# Altium schematic sheet SoC_PS_500_501_502_MIO.SchDoc: RFSoC AMC
size 420 x 297 mm; CompanyName: WUT; DrawnBy: T. Przywozki; Organization: WUT ISE; Address1: Warsaw University of Technology; Address2: Nowowiejska 15/19 00-665 Warsaw; Address3: Tomasz.Przywozki@pw.edu.pl; DocumentNumber: 8; Revision: 1; SheetNumber: 8; SheetTotal: 45; Project: RFSoC AMC; ModifiedBy: T. Przywozki; CreateDate: -; CheckedDate: -; DivGrp: ISE; Designer: T. Przywozki; ModifiedDate: -; ProjectName: ADC/DAC MEZZANINE
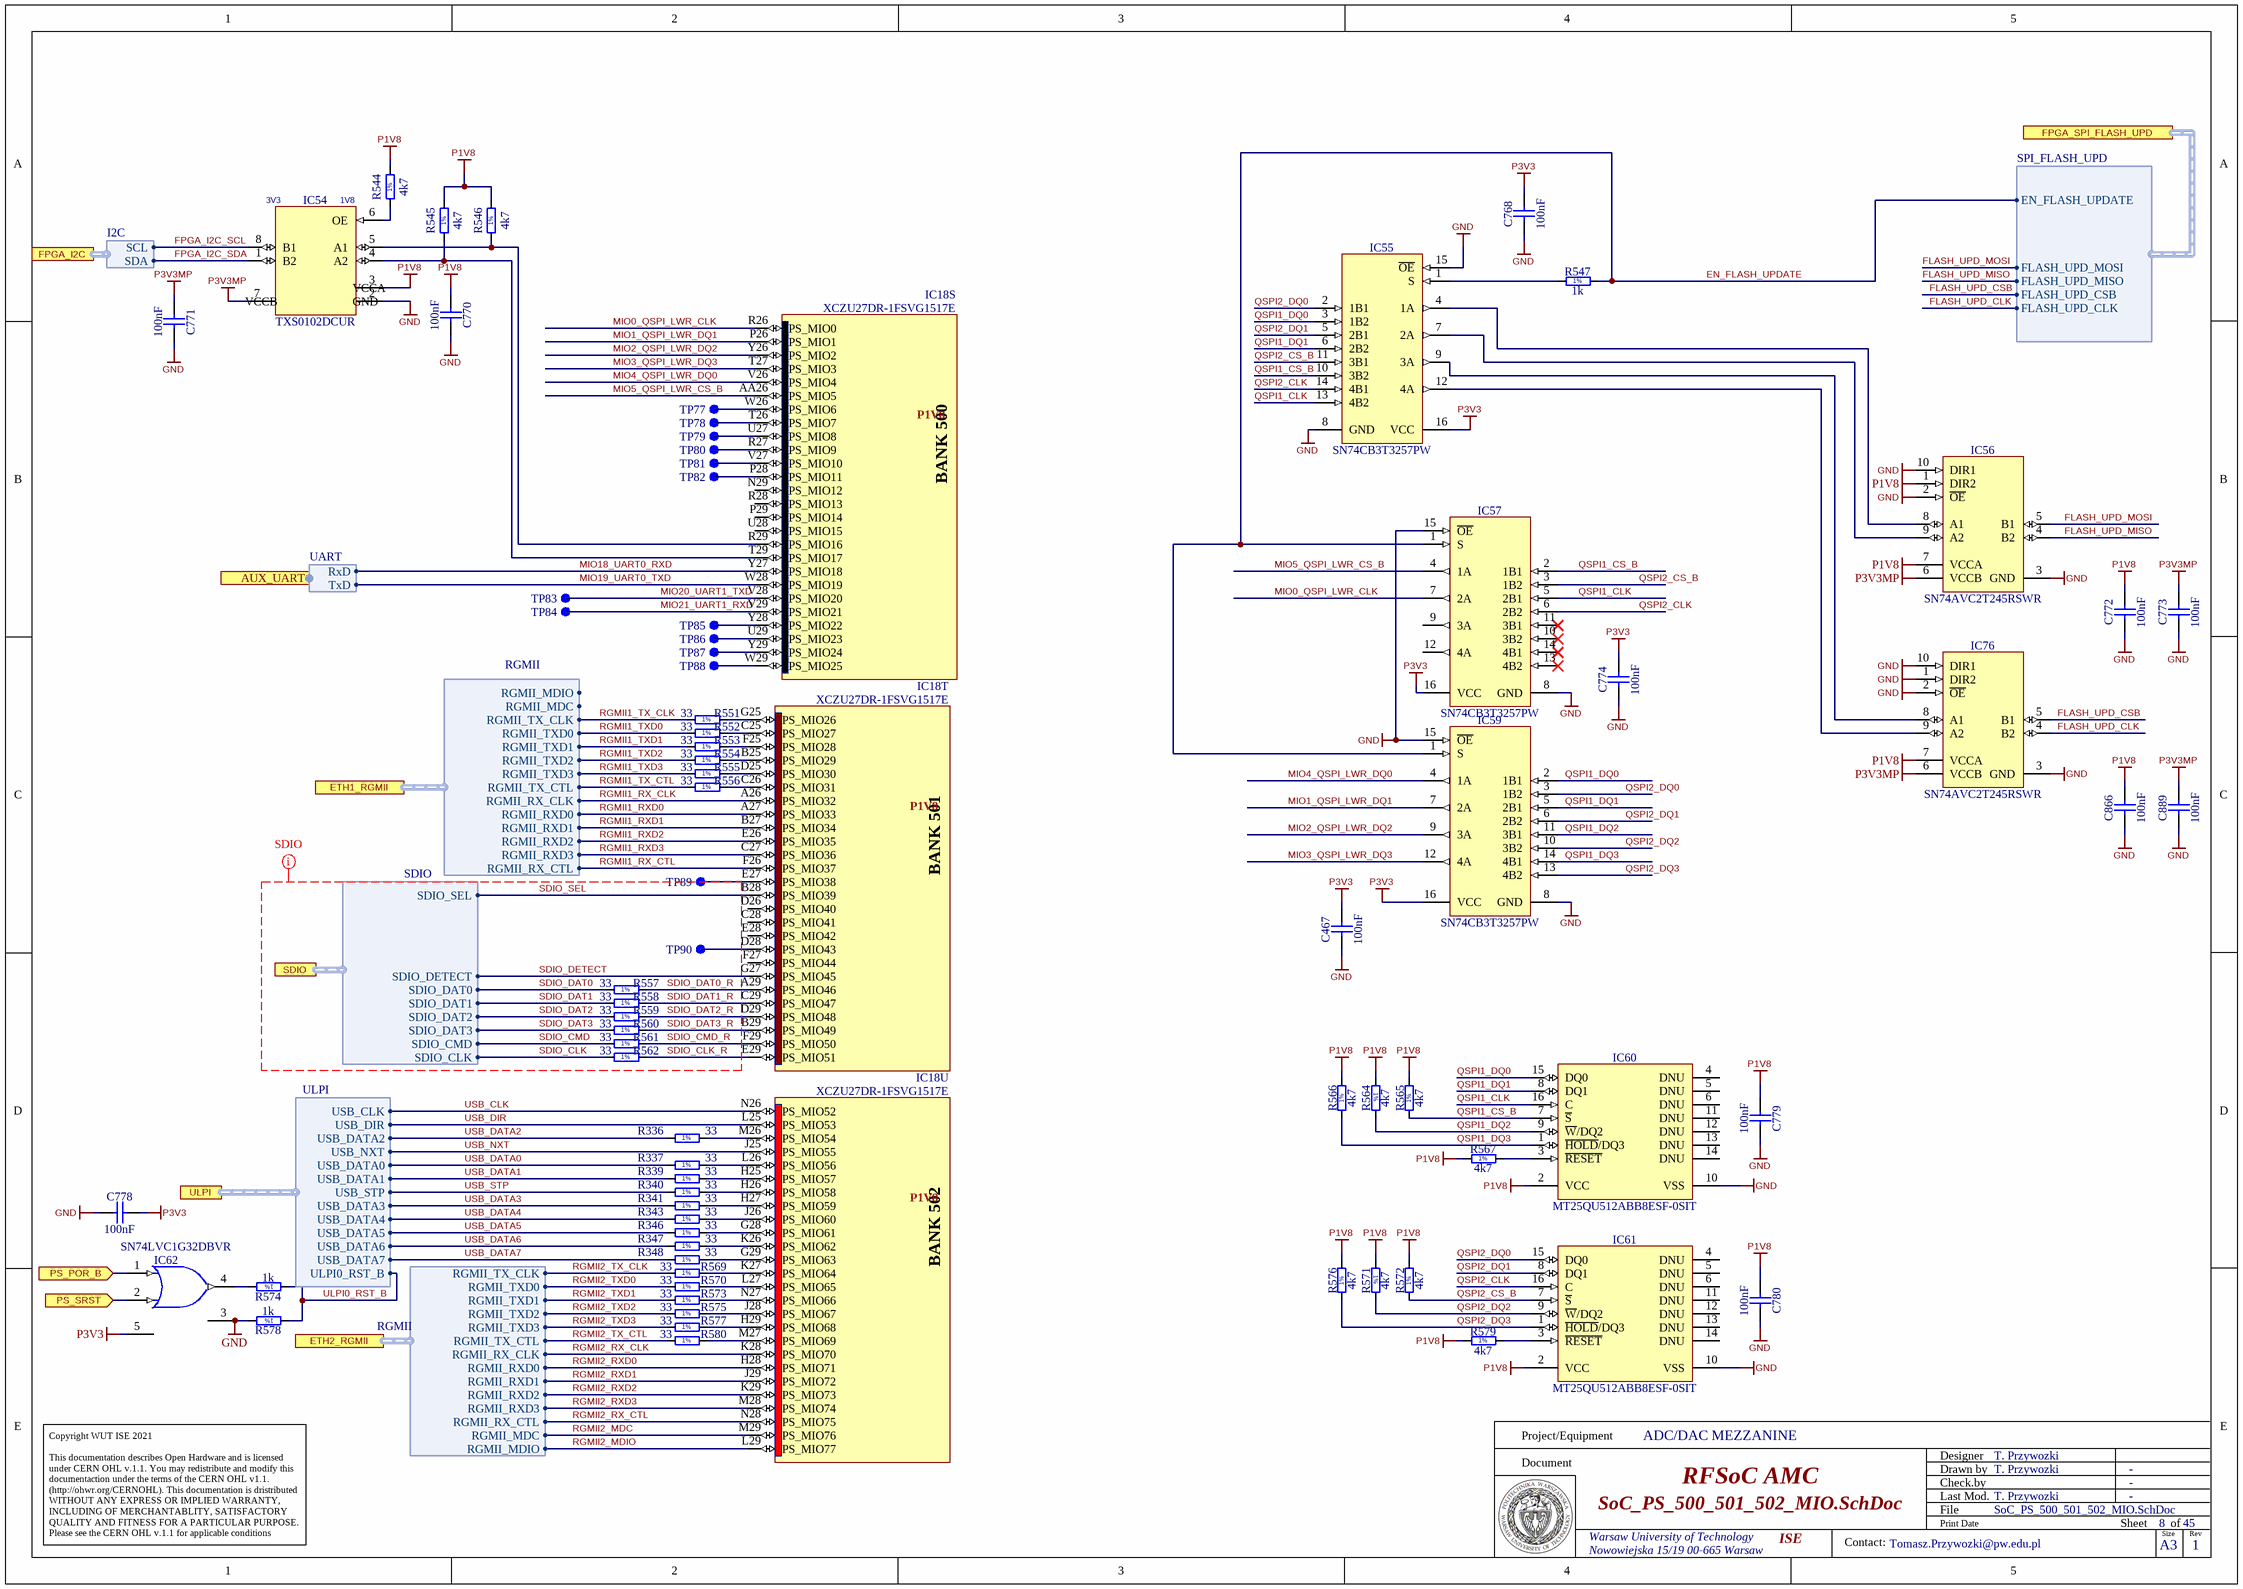
[diagram p0: SoC_PS_500_501_502_MIO.SchDoc]

## Parts
C467  100nF  [CAPC0603X33N]
C768  100nF  [CAPC0603X33N]
C770  100nF  [CAPC0603X33N]
C771  100nF  [CAPC0603X33N]
C772  100nF  [CAPC0603X33N]
C773  100nF  [CAPC0603X33N]
C774  100nF  [CAPC0603X33N]
C778  100nF  [CAPC0603X33N]
C779  100nF  [CAPC0603X33N]
C780  100nF  [CAPC0603X33N]
C866  100nF  [CAPC0603X33N]
C889  100nF  [CAPC0603X33N]
IC18  XCZU27DR-1FSVG1517E  [XILINX_FSVG1517 (XCZU27DR)]  (parts S,T,U of 31)
IC54  TXS0102DCUR  [SOP50P310X90-8N]
IC55  SN74CB3T3257PW  [SOP65P640X120-16N]
IC56  SN74AVC2T245RSWR  [QFN40P140X180X55-10N]
IC57  SN74CB3T3257PW  [SOP65P640X120-16N]
IC59  SN74CB3T3257PW  [SOP65P640X120-16N]
IC60  MT25QU512ABB8ESF-0SIT  [SOIC127P1030X265-16N]
IC61  MT25QU512ABB8ESF-0SIT  [SOIC127P1030X265-16N]
IC62  SN74LVC1G32DBVR  [SOT95P280X145-5N]
IC76  SN74AVC2T245RSWR  [QFN40P140X180X55-10N]
R336  33  [RESC1005X40N]
R337  33  [RESC1005X40N]
R339  33  [RESC1005X40N]
R340  33  [RESC1005X40N]
R341  33  [RESC1005X40N]
R343  33  [RESC1005X40N]
R346  33  [RESC1005X40N]
R347  33  [RESC1005X40N]
R348  33  [RESC1005X40N]
R544  4k7  [RESC1005X40N]
R545  4k7  [RESC1005X40N]
R546  4k7  [RESC1005X40N]
R547  1k  [RESC1005X40N]
R551  33  [RESC1005X40N]
R552  33  [RESC1005X40N]
R553  33  [RESC1005X40N]
R554  33  [RESC1005X40N]
R555  33  [RESC1005X40N]
R556  33  [RESC1005X40N]
R557  33  [RESC1005X40N]
R558  33  [RESC1005X40N]
R559  33  [RESC1005X40N]
R560  33  [RESC1005X40N]
R561  33  [RESC1005X40N]
R562  33  [RESC1005X40N]
R564  4k7  [RESC1005X40N]
R565  4k7  [RESC1005X40N]
R566  4k7  [RESC1005X40N]
R567  4k7  [RESC1005X40N]
R569  33  [RESC1005X40N]
R570  33  [RESC1005X40N]
R571  4k7  [RESC1005X40N]
R572  4k7  [RESC1005X40N]
R573  33  [RESC1005X40N]
R574  1k  [RESC1005X40N]
R575  33  [RESC1005X40N]
R576  4k7  [RESC1005X40N]
R577  33  [RESC1005X40N]
R578  1k  [RESC1005X40N]
R579  4k7  [RESC1005X40N]
R580  33  [RESC1005X40N]
TP77  SMD Pad  [C100]  (value not drawn)
TP78  SMD Pad  [C100]  (value not drawn)
TP79  SMD Pad  [C100]  (value not drawn)
TP80  SMD Pad  [C100]  (value not drawn)
TP81  SMD Pad  [C100]  (value not drawn)
TP82  SMD Pad  [C100]  (value not drawn)
TP83  SMD Pad  [C100]  (value not drawn)
TP84  SMD Pad  [C100]  (value not drawn)
TP85  SMD Pad  [C100]  (value not drawn)
TP86  SMD Pad  [C100]  (value not drawn)
TP87  SMD Pad  [C100]  (value not drawn)
TP88  SMD Pad  [C100]  (value not drawn)
TP89  SMD Pad  [C100]  (value not drawn)
TP90  SMD Pad  [C100]  (value not drawn)

## Ports
AUX_UART (harness UART), ETH1_RGMII (harness RGMII), ETH2_RGMII (harness RGMII), FPGA_I2C (harness I2C), FPGA_SPI_FLASH_UPD (harness SPI_FLASH_UPD), PS_POR_B (in), PS_SRST (in), SDIO (harness SDIO), ULPI (harness ULPI)

## Harnesses
SDIO: SDIO_SEL, SDIO_DETECT, SDIO_DAT0, SDIO_DAT1, SDIO_DAT2, SDIO_DAT3, SDIO_CMD, SDIO_CLK
SPI_FLASH_UPD: EN_FLASH_UPDATE, FLASH_UPD_MOSI, FLASH_UPD_MISO, FLASH_UPD_CSB, FLASH_UPD_CLK
I2C: SCL, SDA
ULPI: USB_CLK, USB_DIR, USB_DATA2, USB_NXT, USB_DATA0, USB_DATA1, USB_STP, USB_DATA3, USB_DATA4, USB_DATA5, USB_DATA6, USB_DATA7, ULPI0_RST_B
RGMII: RGMII_TX_CLK, RGMII_TXD0, RGMII_TXD1, RGMII_TXD2, RGMII_TXD3, RGMII_TX_CTL, RGMII_RX_CLK, RGMII_RXD0, RGMII_RXD1, RGMII_RXD2, RGMII_RXD3, RGMII_RX_CTL, RGMII_MDC, RGMII_MDIO
UART: RxD, TxD

## Nets
GND: C467.1 C768.1 C770.1 C771.1 C772.1 C773.1 C774.1 C778.1 C779.1 C780.1 C866.1 C889.1 IC54.2(GND) IC55.8(GND) IC55.15(~{OE}) IC56.2(~{OE}) IC56.3(GND) IC56.10(DIR1) IC57.8(GND) IC57.15(~{OE}) IC59.8(GND) IC59.15(~{OE}) IC60.10(VSS) IC61.10(VSS) IC62.3(GND) IC76.1(DIR2) IC76.2(~{OE}) IC76.3(GND) IC76.10(DIR1) R578.2
P1V8: C770.2 C772.2 C779.2 C780.2 C866.2 IC54.3(Vcca) IC56.1(DIR2) IC56.7(VCCA) IC60.2(VCC) IC61.2(VCC) IC76.7(VCCA) R544.2 R545.2 R546.2 R564.1 R565.2 R566.2 R567.1 R571.1 R572.2 R576.2 R579.1
P3V3: C467.2 C768.2 C774.2 C778.2 IC55.16(VCC) IC57.16(VCC) IC59.16(VCC) IC62.5(VCC)
P3V3MP: C771.2 C773.2 C889.2 IC54.7(Vccb) IC56.6(VCCB) IC76.6(VCCB)
EN_FLASH_UPDATE: IC57.1(S) IC59.1(S) R547.2 ; port FPGA_SPI_FLASH_UPD.EN_FLASH_UPDATE
FLASH_UPD_CLK: IC76.4(B2) ; port FPGA_SPI_FLASH_UPD.FLASH_UPD_CLK
FLASH_UPD_CSB: IC76.5(B1) ; port FPGA_SPI_FLASH_UPD.FLASH_UPD_CSB
FLASH_UPD_MISO: IC56.4(B2) ; port FPGA_SPI_FLASH_UPD.FLASH_UPD_MISO
FLASH_UPD_MOSI: IC56.5(B1) ; port FPGA_SPI_FLASH_UPD.FLASH_UPD_MOSI
FPGA_I2C_SCL: IC54.8(B1) ; port FPGA_I2C.SCL
FPGA_I2C_SDA: IC54.1(B2) ; port FPGA_I2C.SDA
MIO0_QSPI_LWR_CLK: IC18.R26(PS_MIO0) IC57.7(2A)
MIO1_QSPI_LWR_DQ1: IC18.P26(PS_MIO1) IC59.7(2A)
MIO2_QSPI_LWR_DQ2: IC18.Y26(PS_MIO2) IC59.9(3A)
MIO3_QSPI_LWR_DQ3: IC18.T27(PS_MIO3) IC59.12(4A)
MIO4_QSPI_LWR_DQ0: IC18.V26(PS_MIO4) IC59.4(1A)
MIO5_QSPI_LWR_CS_B: IC18.AA26(PS_MIO5) IC57.4(1A)
MIO18_UART0_RXD: IC18.Y27(PS_MIO18) ; port AUX_UART.RxD
MIO19_UART0_TXD: IC18.W28(PS_MIO19) ; port AUX_UART.TxD
MIO20_UART1_TXD: IC18.V28(PS_MIO20) TP83.1
MIO21_UART1_RXD: IC18.V29(PS_MIO21) TP84.1
PS_POR_B: IC62.1(A) ; port PS_POR_B
PS_SRST: IC62.2(B) ; port PS_SRST
QSPI1_CLK: IC55.13(4B2) IC57.5(2B1) IC60.16(C)
QSPI1_CS_B: IC55.10(3B2) IC57.2(1B1) IC60.7(~{S}) R565.1
QSPI1_DQ0: IC55.3(1B2) IC59.2(1B1) IC60.15(DQ0)
QSPI1_DQ1: IC55.6(2B2) IC59.5(2B1) IC60.8(DQ1)
QSPI1_DQ2: IC59.11(3B1) IC60.9(~{W}/DQ2) R564.2
QSPI1_DQ3: IC59.14(4B1) IC60.1(~{HOLD}/DQ3) R566.1
QSPI2_CLK: IC55.14(4B1) IC57.6(2B2) IC61.16(C)
QSPI2_CS_B: IC55.11(3B1) IC57.3(1B2) IC61.7(~{S}) R572.1
QSPI2_DQ0: IC55.2(1B1) IC59.3(1B2) IC61.15(DQ0)
QSPI2_DQ1: IC55.5(2B1) IC59.6(2B2) IC61.8(DQ1)
QSPI2_DQ2: IC59.10(3B2) IC61.9(~{W}/DQ2) R571.2
QSPI2_DQ3: IC59.13(4B2) IC61.1(~{HOLD}/DQ3) R576.1
RGMII1_RX_CLK: IC18.A26(PS_MIO32) ; port ETH1_RGMII.RGMII_RX_CLK
RGMII1_RX_CTL: IC18.F26(PS_MIO37) ; port ETH1_RGMII.RGMII_RX_CTL
RGMII1_RXD0: IC18.A27(PS_MIO33) ; port ETH1_RGMII.RGMII_RXD0
RGMII1_RXD1: IC18.B27(PS_MIO34) ; port ETH1_RGMII.RGMII_RXD1
RGMII1_RXD2: IC18.E26(PS_MIO35) ; port ETH1_RGMII.RGMII_RXD2
RGMII1_RXD3: IC18.C27(PS_MIO36) ; port ETH1_RGMII.RGMII_RXD3
RGMII1_TX_CLK: R551.1 ; port ETH1_RGMII.RGMII_TX_CLK
RGMII1_TX_CTL: R556.1 ; port ETH1_RGMII.RGMII_TX_CTL
RGMII1_TXD0: R552.1 ; port ETH1_RGMII.RGMII_TXD0
RGMII1_TXD1: R553.1 ; port ETH1_RGMII.RGMII_TXD1
RGMII1_TXD2: R554.1 ; port ETH1_RGMII.RGMII_TXD2
RGMII1_TXD3: R555.1 ; port ETH1_RGMII.RGMII_TXD3
RGMII2_MDC: IC18.M29(PS_MIO76) ; port ETH2_RGMII.RGMII_MDC
RGMII2_MDIO: IC18.L29(PS_MIO77) ; port ETH2_RGMII.RGMII_MDIO
RGMII2_RX_CLK: IC18.K28(PS_MIO70) ; port ETH2_RGMII.RGMII_RX_CLK
RGMII2_RX_CTL: IC18.N28(PS_MIO75) ; port ETH2_RGMII.RGMII_RX_CTL
RGMII2_RXD0: IC18.H28(PS_MIO71) ; port ETH2_RGMII.RGMII_RXD0
RGMII2_RXD1: IC18.J29(PS_MIO72) ; port ETH2_RGMII.RGMII_RXD1
RGMII2_RXD2: IC18.K29(PS_MIO73) ; port ETH2_RGMII.RGMII_RXD2
RGMII2_RXD3: IC18.M28(PS_MIO74) ; port ETH2_RGMII.RGMII_RXD3
RGMII2_TX_CLK: R569.1 ; port ETH2_RGMII.RGMII_TX_CLK
RGMII2_TX_CTL: R580.1 ; port ETH2_RGMII.RGMII_TX_CTL
RGMII2_TXD0: R570.1 ; port ETH2_RGMII.RGMII_TXD0
RGMII2_TXD1: R573.1 ; port ETH2_RGMII.RGMII_TXD1
RGMII2_TXD2: R575.1 ; port ETH2_RGMII.RGMII_TXD2
RGMII2_TXD3: R577.1 ; port ETH2_RGMII.RGMII_TXD3
SDIO_CLK: R562.1 ; port SDIO.SDIO_CLK
SDIO_CLK_R: IC18.E29(PS_MIO51) R562.2
SDIO_CMD: R561.1 ; port SDIO.SDIO_CMD
SDIO_CMD_R: IC18.F29(PS_MIO50) R561.2
SDIO_DAT0: R557.1 ; port SDIO.SDIO_DAT0
SDIO_DAT0_R: IC18.A29(PS_MIO46) R557.2
SDIO_DAT1: R558.1 ; port SDIO.SDIO_DAT1
SDIO_DAT1_R: IC18.C29(PS_MIO47) R558.2
SDIO_DAT2: R559.1 ; port SDIO.SDIO_DAT2
SDIO_DAT2_R: IC18.D29(PS_MIO48) R559.2
SDIO_DAT3: R560.1 ; port SDIO.SDIO_DAT3
SDIO_DAT3_R: IC18.B29(PS_MIO49) R560.2
SDIO_DETECT: IC18.G27(PS_MIO45) ; port SDIO.SDIO_DETECT
SDIO_SEL: IC18.B28(PS_MIO39) ; port SDIO.SDIO_SEL
ULPI0_RST_B: R574.1 R578.1 ; port ULPI.ULPI0_RST_B
USB_CLK: IC18.N26(PS_MIO52) ; port ULPI.USB_CLK
USB_DATA0: R337.1 ; port ULPI.USB_DATA0
USB_DATA1: R339.1 ; port ULPI.USB_DATA1
USB_DATA2: R336.1 ; port ULPI.USB_DATA2
USB_DATA3: R341.1 ; port ULPI.USB_DATA3
USB_DATA4: R343.1 ; port ULPI.USB_DATA4
USB_DATA5: R346.1 ; port ULPI.USB_DATA5
USB_DATA6: R347.1 ; port ULPI.USB_DATA6
USB_DATA7: R348.1 ; port ULPI.USB_DATA7
USB_DIR: IC18.L25(PS_MIO53) ; port ULPI.USB_DIR
USB_NXT: IC18.J25(PS_MIO55) ; port ULPI.USB_NXT
USB_STP: R340.1 ; port ULPI.USB_STP
NetIC18_B25: IC18.B25(PS_MIO29) R554.2
NetIC18_C25: IC18.C25(PS_MIO27) R552.2
NetIC18_C26: IC18.C26(PS_MIO31) R556.2
NetIC18_D25: IC18.D25(PS_MIO30) R555.2
NetIC18_D28: IC18.D28(PS_MIO43) TP90.1
NetIC18_E27: IC18.E27(PS_MIO38) TP89.1
NetIC18_F25: IC18.F25(PS_MIO28) R553.2
NetIC18_G25: IC18.G25(PS_MIO26) R551.2
NetIC18_G28: IC18.G28(PS_MIO61) R346.2
NetIC18_G29: IC18.G29(PS_MIO63) R348.2
NetIC18_H25: IC18.H25(PS_MIO57) R339.2
NetIC18_H26: IC18.H26(PS_MIO58) R340.2
NetIC18_H27: IC18.H27(PS_MIO59) R341.2
NetIC18_H29: IC18.H29(PS_MIO68) R577.2
NetIC18_J26: IC18.J26(PS_MIO60) R343.2
NetIC18_J28: IC18.J28(PS_MIO67) R575.2
NetIC18_K26: IC18.K26(PS_MIO62) R347.2
NetIC18_K27: IC18.K27(PS_MIO64) R569.2
NetIC18_L26: IC18.L26(PS_MIO56) R337.2
NetIC18_L27: IC18.L27(PS_MIO65) R570.2
NetIC18_M26: IC18.M26(PS_MIO54) R336.2
NetIC18_M27: IC18.M27(PS_MIO69) R580.2
NetIC18_N27: IC18.N27(PS_MIO66) R573.2
NetIC18_P28: IC18.P28(PS_MIO11) TP82.1
NetIC18_R27: IC18.R27(PS_MIO9) TP80.1
NetIC18_R29: IC18.R29(PS_MIO16) IC54.5(A1) R546.1
NetIC18_T26: IC18.T26(PS_MIO7) TP78.1
NetIC18_T29: IC18.T29(PS_MIO17) IC54.4(A2) R545.1
NetIC18_U27: IC18.U27(PS_MIO8) TP79.1
NetIC18_U29: IC18.U29(PS_MIO23) TP86.1
NetIC18_V27: IC18.V27(PS_MIO10) TP81.1
NetIC18_W26: IC18.W26(PS_MIO6) TP77.1
NetIC18_W29: IC18.W29(PS_MIO25) TP88.1
NetIC18_Y28: IC18.Y28(PS_MIO22) TP85.1
NetIC18_Y29: IC18.Y29(PS_MIO24) TP87.1
NetIC54_6: IC54.6(OE) R544.1
NetIC55_1: IC55.1(S) R547.1
NetIC55_4: IC55.4(1A) IC56.8(A1)
NetIC55_7: IC55.7(2A) IC56.9(A2)
NetIC55_9: IC55.9(3A) IC76.8(A1)
NetIC55_12: IC55.12(4A) IC76.9(A2)
NetIC60_3: IC60.3(~{RESET}) R567.2
NetIC61_3: IC61.3(~{RESET}) R579.2
NetIC62_4: IC62.4(Y) R574.2

Not connected (* = marked no-connect by the designer): IC18 C28(PS_MIO41) D26(PS_MIO40) E28(PS_MIO42) F27(PS_MIO44) N29(PS_MIO12) P29(PS_MIO14) R28(PS_MIO13) U28(PS_MIO15); IC57 9(3A) 10(3B2)* 11(3B1)* 12(4A) 13(4B2)* 14(4B1)*; IC60 4(DNU) 5(DNU) 6(DNU) 11(DNU) 12(DNU) 13(DNU) 14(DNU); IC61 4(DNU) 5(DNU) 6(DNU) 11(DNU) 12(DNU) 13(DNU) 14(DNU)

## Layout directives
net class SDIO: SDIO_CLK, SDIO_CLK_R, SDIO_CMD, SDIO_CMD_R, SDIO_DAT0, SDIO_DAT0_R, SDIO_DAT1, SDIO_DAT1_R, SDIO_DAT2, SDIO_DAT2_R, SDIO_DAT3, SDIO_DAT3_R, SDIO_DETECT, SDIO_SEL

## Notes on the sheet
- (near IC54) 3V3
- (near IC54) 1V8
- P1V8
- Project/Equipment
- Document
- Designer
- Drawn by
- Check.by
- Copyright WUT ISE 2021
  This documentation describes Open Hardware and is licensed under CERN OHL v.1.1. You may redistribute and modify this documentaction under the terms of the CERN OHL v1.1.
  (http://ohwr.org/CERNOHL). This documentation is dristributed WITHOUT ANY EXPRESS OR IMPLIED WARRANTY, INCLUDING OF MERCHANTABLITY, SATISFACTORY QUALITY AND FITNESS FOR A PARTICULAR PURPOSE. Please see the CERN OHL v.1.1 for applicable conditions
- File
- Last Mod.
- Print Date
- Sheet
- Size
- A3
- of
- Rev
- Contact:
- (in symbol R0402_1K_1%_0.0625W_100PPM) 1%
- (in symbol R0402_4K7_1%_0.0625W_100PPM) 1%
- (in symbol R0402_33R_1%_0.0625W_100PPM) 1%
- (in symbol TXS0102DCUR) VCCA; VCCB
- (in symbol XCZU27DR-1FSVG1517E, part S) BANK 500
- (in symbol XCZU27DR-1FSVG1517E, part T) BANK 501
- (in symbol XCZU27DR-1FSVG1517E, part U) BANK 502

## Library data of the parts
C467 C768 C770-C774 C778-C780 C866 C889 = CC0201_100NF_6.3V_10%_X5R: Non-polarised capacitor; Manufacturer: GENERIC; Part Description: SMD Multilayer Chip Ceramic Capacitor; Manufacturer1 Part Number: 02016D104KAT2A; Tolerance: ±10%; Voltage: 6.3V; TC: X5R; Manufacturer Part Number: CC0201_100NF_6.3V_10%_X5R; Part Number: CC0201_100NF_6.3V_10%_X5R; Value: 100nF; Component Kind: Standard; Component Type: Standard; Pin Count: 2; Status: Not Recommended; Case: 0201; Mounted: Yes; Socket: No; SMD: Yes; Sense: No; Manufacturer1 Example: AVX; Manufacturer1 ComponentHeight: 0.33mm; HelpURL: \\cern.ch\dfs\Applications\Altium\Datasheets\CC0201_X5R_AVX.pdf; Author: CERN DEM JLC; CreateDate: 03/12/2007; LatestRevisionDate: 03/12/2007
IC18 = XCZU27DR-1FSVG1517E: Zynq UltraScale+ RFSoC, Quad-Core ARM® Cortex™-A53 MPCore™ up to 1.5GHz, 214 PS I/O, 299 HP I/O, 48 HD I/O, 1517-Pin BGA; Manufacturer: XILINX; PressFit: No; Bonding: No; Part Number: XCZU27DR-1FSVG1517E; Component Kind: Standard; Component Type: Standard; Device: XCZU27DR-1FSVG1517E; PackageDescription: BGA, 1.00mm Pitch, Square; 1517 Pin, 39 Columns X 39 Rows, 40.00mm X 40.00mm X 4.01mm H; Part Description: Zynq UltraScale+ RFSoC, Quad-Core ARM® Cortex™-A53 MPCore™ up to 1.5GHz, 214 PS I/O, 299 HP I/O, 48 HD I/O, 1517-Pin BGA; Manufacturer Part Number: XCZU27DR-1FSVG1517E; Pin Count: 1517; Case: BGA1517; Mounted: Yes; Socket: No; SMD: Yes; Sense: No; ComponentHeight: 4.01mm; HelpURL: \\cern.ch\dfs\Applications\Altium\Datasheets\XCZU27DR-1FSVG1517E.pdf; ComponentLink1URL: \\cern.ch\dfs\Applications\Altium\Datasheets\XCZU27DR-1FSVG1517E_Package-Pinout.pdf; ComponentLink1Description: Package/Pinout; ComponentLink2URL: \\cern.ch\dfs\Applications\Altium\Datasheets\XCZU27DR-1FSVG1517E_Pinout.pdf; ComponentLink2Description: Pinout; Author: CERN DEM MR; CreateDate: 02/05/2018; LatestRevisionDate: 02/05/2018
IC54 = TXS0102DCUR: 2-Bit Bidirectionnal Voltage-Level Translator for Open-Drain And Push-Pull Applications; Manufacturer: TEXAS INSTRUMENTS; PressFit: No; Bonding: No; Manufacturer Part Number: TXS0102DCUR; PackageDescription: SOP, 0.50mm Pitch; 8 pin, 2.30mm W X 2.00mm L X 0.90mm H body, PC Medium Density; Part Description: 2-Bit Bidirectionnal Voltage-Level Translator for Open-Drain And Push-Pull Applications; Part Number: TXS0102DCUR; Component Kind: Standard; Component Type: Standard; Device: TXS0102DCUR; Pin Count: 8; Case: TSSOP8; Mounted: Yes; Socket: No; SMD: Yes; Sense: No; ComponentHeight: 0.9mm; Author: CERN DEM JLC; HelpURL: \\cern.ch\dfs\Applications\Altium\Datasheets\TXS0102DCUR.pdf; CreateDate: 08/07/2014; LatestRevisionDate: 08/07/2014
IC55 IC57 IC59 = SN74CB3T3257PW: 4-BIT 1-OF-2 FET Multiplexer/Demultiplexer 2.5V/3.3V Low-Voltage Bus Switch 5V Tolerant Shifter; Manufacturer: TEXAS INSTRUMENTS; PressFit: No; Bonding: No; Manufacturer Part Number: SN74CB3T3257PW; PackageDescription: SOP, 0.65mm pitch; 16 pin, 4.40mm W X 5.00mm L X 1.20mm H body IPC Medium Density; Part Description: 4-Bit 1-of-2 FET Multiplexer/Demultiplexer 2.5V/3.3V Low-Voltage Bus Switch 5V Tolerant Shifter; Part Number: SN74CB3T3257PW; Component Kind: Standard; Component Type: Standard; Device: SN74CB3T3257PW; Pin Count: 16; Case: TSSOP16; Mounted: Yes; Socket: No; SMD: Yes; Sense: No; ComponentHeight: 1.2mm; Author: CERN DEM JLC; HelpURL: \\cern.ch\dfs\Applications\Altium\Datasheets\SN74CB3T3257PW.pdf; CreateDate: 30/01/2012; LatestRevisionDate: 30/01/2012
IC56 IC76 = SN74AVC2T245RSWR: Dual-Bit Dual-Supply Bus Transceiver With Configurable Voltage Translation and 3-State Outputs; Manufacturer: TEXAS INSTRUMENTS; PressFit: No; Bonding: No; Manufacturer Part Number: SN74AVC2T245RSWR; PackageDescription: QFN, 0.40mm Pitch, Rect.;10 Pin, 1.80mm L X 1.40mm W X 0.55mm H Body, IPC Medium Density; Part Description: Dual-Bit Dual-Supply Bus Transceiver With Configurable Voltage Translation and 3-State Outputs; Part Number: SN74AVC2T245RSWR; Component Kind: Standard; Component Type: Standard; Device: SN74AVC2T245RSWR; Status: Not Recommended; Pin Count: 10; Case: QFN10; Mounted: Yes; Socket: No; SMD: Yes; Sense: No; ComponentHeight: 0.55mm; Author: CERN DEM JLC; HelpURL: \\cern.ch\dfs\Applications\Altium\Datasheets\SN74AVC2T245RSWR.pdf; CreateDate: 07.07.2014; LatestRevisionDate: 30.03.2017
IC60 IC61 = MT25QU512ABB8ESF-0SIT: 512Mbit (64MB), 1.8V, Multiple I/O Serial Flash Memory, Reset# & Hold# Pins; Manufacturer: MICRON TECHNOLOGY; PressFit: No; Bonding: No; Part Number: MT25QU512ABB8ESF-0SIT; Component Kind: Standard; Component Type: Standard; Device: MT25QU512ABB8ESF-0SIT; PackageDescription: SOIC 16, Pitch 1.27mm - Body 7.5x10.3mm, IPC Medium Density; Part Description: 512Mbit (64MB), 1.8V, Multiple I/O Serial Flash Memory, Reset# & Hold# Pins; Manufacturer Part Number: MT25QU512ABB8ESF-0SIT; Pin Count: 16; Case: SOIC16; Mounted: Yes; Socket: No; SMD: Yes; Sense: No; ComponentHeight: 2.65mm; HelpURL: \\cern.ch\dfs\Applications\Altium\Datasheets\MT25QU512ABB8ESF.pdf; Author: CERN DEM MR; CreateDate: 03.06.2016; LatestRevisionDate: 03.06.2016
IC62 = SN74LVC1G32DBVR: Single 2-Input Positive-OR Gate; Manufacturer: TEXAS INSTRUMENTS; PressFit: No; Bonding: No; Manufacturer Part Number: SN74LVC1G32DBVR; PackageDescription: SOT, 0.95mm pitch; 5 pin, 1.60mm W X 2.90mm L X 1.45mm H body, IPC Medium Density; Part Description: Single 2-Input Positive-OR Gate; Part Number: SN74LVC1G32DBVR; Component Kind: Standard; Component Type: Standard; Device: SN74LVC1G32DBVR; Pin Count: 5; Case: SOT23-5; Mounted: Yes; Socket: No; SMD: Yes; Sense: No; ComponentHeight: 1.45mm; Author: CERN DEM JLC; HelpURL: \\cern.ch\dfs\Applications\Altium\Datasheets\SN74LVC1G32DBVR.pdf; CreateDate: 25/04/2012; LatestRevisionDate: 25/04/2012
R336 R337 R339-R341 R343 R346-R348 = R0402_33R_1%_0.0625W_100PPM: Resistor - 1%; Manufacturer: GENERIC; Part Description: General Purpose Thick Film Chip Resistor; Manufacturer1 Part Number: 232270673309L; TC: ±100ppm/°C; PressFit: No; Manufacturer Part Number: R0402_33R_1%_0.0625W_100PPM; Part Number: R0402_33R_1%_0.0625W_100PPM; Tolerance: ±1%; Value: 33; Component Kind: Standard; Component Type: Standard; Pin Count: 2; Status: Not Recommended; Power: 0.0625W; Case: 0402; Mounted: Yes; Sense: No; Socket: No; SMD: Yes; Manufacturer1 Example: YAGEO PHYCOMP; Manufacturer1 ComponentHeight: 0.4mm; HelpURL: \\cern.ch\dfs\Applications\Altium\Datasheets\R0402_Phycomp_RC0402.pdf; Author: CERN DEM JLC; CreateDate: 03/12/2007; LatestRevisionDate: 17/10/2012
R544-R546 R564-R567 R571 R572 R576 R579 = R0402_4K7_1%_0.0625W_100PPM: Resistor - 1%; Manufacturer: GENERIC; Part Description: General Purpose Thick Film Chip Resistor; Manufacturer1 Part Number: 232270674702L; TC: ±100ppm/°C; PressFit: No; Manufacturer Part Number: R0402_4K7_1%_0.0625W_100PPM; Part Number: R0402_4K7_1%_0.0625W_100PPM; Tolerance: ±1%; Value: 4k7; Component Kind: Standard; Component Type: Standard; Pin Count: 2; Status: Not Recommended; Power: 0.0625W; Case: 0402; Mounted: Yes; Sense: No; Socket: No; SMD: Yes; Manufacturer1 Example: YAGEO PHYCOMP; Manufacturer1 ComponentHeight: 0.4mm; HelpURL: \\cern.ch\dfs\Applications\Altium\Datasheets\R0402_Phycomp_RC0402.pdf; Author: CERN DEM JLC; CreateDate: 03/12/2007; LatestRevisionDate: 17/10/2012
R547 = R0402_1K_1%_0.0625W_100PPM: Resistor - 1%; Manufacturer: GENERIC; Part Description: General Purpose Thick Film Chip Resistor; Manufacturer1 Part Number: 232270671002L; TC: ±100ppm/°C; PressFit: No; Manufacturer Part Number: R0402_1K_1%_0.0625W_100PPM; Part Number: R0402_1K_1%_0.0625W_100PPM; Tolerance: ±1%; Value: 1k; Component Kind: Standard; Component Type: Standard; Pin Count: 2; Status: Not Recommended; Power: 0.0625W; Case: 0402; Mounted: Yes; Sense: No; Socket: No; SMD: Yes; Manufacturer1 Example: YAGEO PHYCOMP; Manufacturer1 ComponentHeight: 0.4mm; HelpURL: \\cern.ch\dfs\Applications\Altium\Datasheets\R0402_Phycomp_RC0402.pdf; Author: CERN DEM JLC; CreateDate: 03/12/2007; LatestRevisionDate: 17/10/2012
R551-R562 R569 R570 R573 R575 R577 R580 = R0402_33R_1%_0.0625W_100PPM: Resistor - 1%; Part Description: General Purpose Thick Film Chip Resistor; Manufacturer: GENERIC; Manufacturer1 Part Number: 232270673309L; TC: ±100ppm/°C; PressFit: No; Part Number: R0402_33R_1%_0.0625W_100PPM; Component Kind: Standard; Component Type: Standard; Pin Count: 2; Value: 33; Status: Not Recommended; Power: 0.0625W; Tolerance: ±1%; Manufacturer Part Number: R0402_33R_1%_0.0625W_100PPM; Case: 0402; Mounted: Yes; Sense: No; Socket: No; SMD: Yes; Manufacturer1 Example: YAGEO PHYCOMP; Manufacturer1 ComponentHeight: 0.4mm; HelpURL: \\cern.ch\dfs\Applications\Altium\Datasheets\R0402_Phycomp_RC0402.pdf; Author: CERN DEM JLC; CreateDate: 03/12/2007; LatestRevisionDate: 17/10/2012
R574 R578 = R0402_1K_1%_0.0625W_100PPM: Resistor - 1%; Part Description: General Purpose Thick Film Chip Resistor; Manufacturer: GENERIC; Manufacturer1 Part Number: 232270671002L; TC: ±100ppm/°C; PressFit: No; Part Number: R0402_1K_1%_0.0625W_100PPM; Component Kind: Standard; Component Type: Standard; Pin Count: 2; Value: 1k; Status: Not Recommended; Power: 0.0625W; Tolerance: ±1%; Manufacturer Part Number: R0402_1K_1%_0.0625W_100PPM; Case: 0402; Mounted: Yes; Sense: No; Socket: No; SMD: Yes; Manufacturer1 Example: YAGEO PHYCOMP; Manufacturer1 ComponentHeight: 0.4mm; HelpURL: \\cern.ch\dfs\Applications\Altium\Datasheets\R0402_Phycomp_RC0402.pdf; Author: CERN DEM JLC; CreateDate: 03/12/2007; LatestRevisionDate: 17/10/2012
TP77-TP90 = SMD_PAD_D1MM: Through Hole Pad; Part Description: 1mm Diameter SMD Pad; Mounted: No; PackageDescription: 1mm Diameter SMD Pad; Part Number: SMD_PAD_D1MM; Component Kind: Standard (No BOM); Component Type: Standard (No BOM); Pin Count: 1; Family: SMD Pad; Socket: No; SMD: No; Sense: No; Status: None; ComponentHeight: 0mm; HelpURL: Undefined; Author: CERN DEM JLC; CreateDate: 10.10.2017; LatestRevisionDate: 10.10.2017